# EAGLE schematic Solar_Irradiance_Sensor (EAGLE 7.1.0)
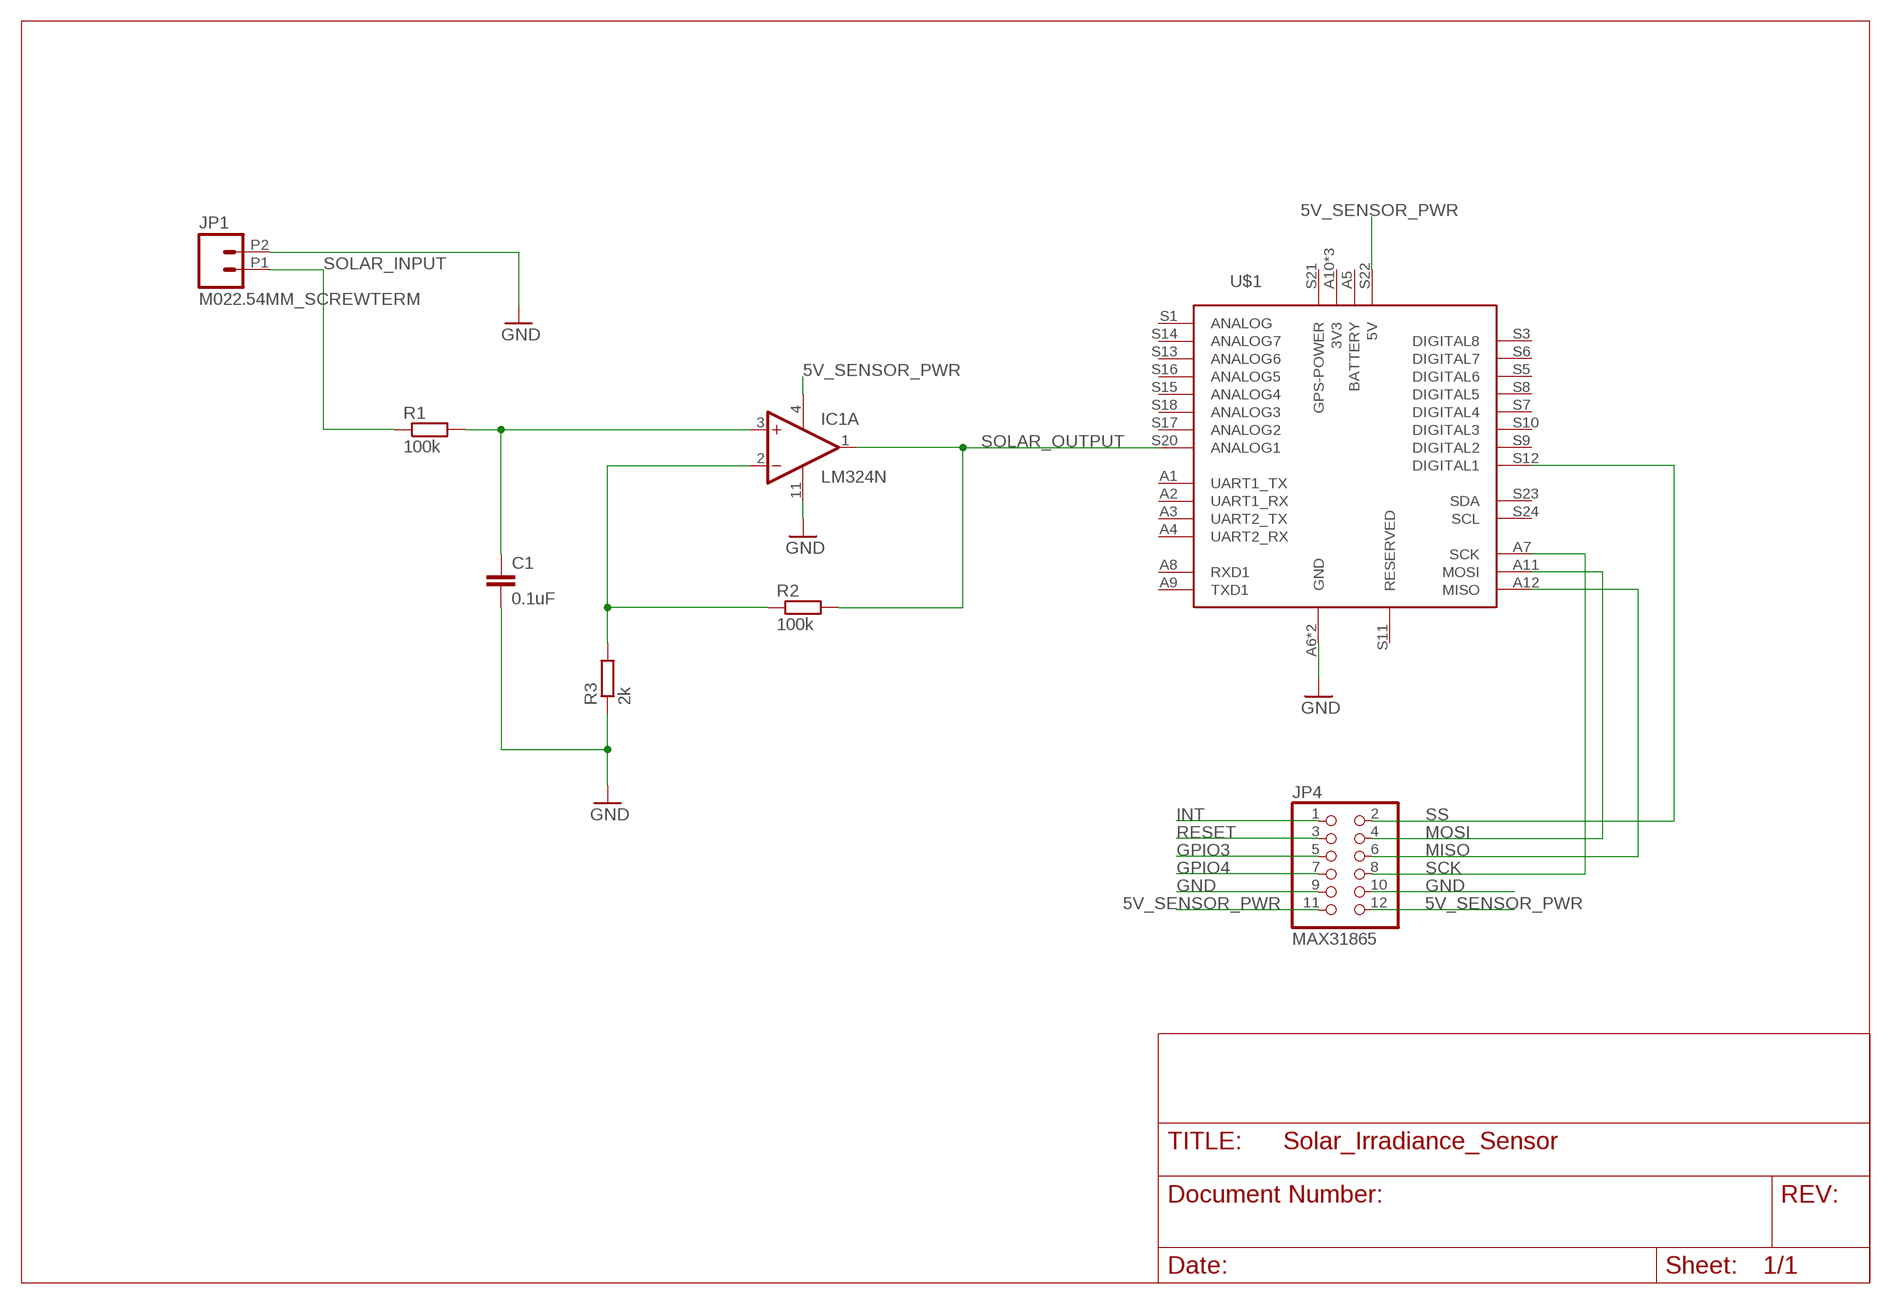
[diagram p0: schematic, sheet 1]

## Parts
C1  0.1uF  C-EU025-024X044  [C025-024X044]
IC1  LM324N  [DIL14]
JP1  M022.54MM_SCREWTERM  [1X02_2.54_SCREWTERM]
JP4  MAX31865  PINHD-2X6  [2X06]
R1  100k  R-EU_0207/10  [0207/10]
R2  100k  R-EU_0207/10  [0207/10]
R3  2k  R-EU_0207/10  [0207/10]
U$1  WASP  [WASP]

## Nets
5V_SENSOR_PWR: IC1.4(P:V+) JP4.11 JP4.12 U$1.S22(5V)
GND: C1.2 IC1.11(P:V-) JP1.P2 JP4.9 JP4.10 R3.1 U$1.A6(GND) U$1.S4(GND)
GPIO3: JP4.5
GPIO4: JP4.7
INT: JP4.1
MISO: JP4.6 U$1.A12(MISO)
MOSI: JP4.4 U$1.A11(MOSI)
N$1: IC1.2(A:-IN) R2.1 R3.2
N$3: C1.1 IC1.3(A:+IN) R1.2
RESET: JP4.3
SCK: JP4.8 U$1.A7(SCK)
SOLAR_INPUT: JP1.P1 R1.1
SOLAR_OUTPUT: IC1.1(A:OUT) R2.2 U$1.S20(ANALOG1)
SS: JP4.2 U$1.S12(DIGITAL1)
Unconnected: IC1.5(B:+IN) IC1.6(B:-IN) IC1.7(B:OUT) IC1.8(C:OUT) IC1.9(C:-IN) IC1.10(C:+IN) IC1.12(D:+IN) IC1.13(D:-IN) IC1.14(D:OUT) U$1.A1(UART1_TX) U$1.A2(UART1_RX) U$1.A3(UART2_TX) U$1.A4(UART2_RX) U$1.A5(BATTERY) U$1.A8(RXD1) U$1.A9(TXD1) U$1.A10(3V3) U$1.S1(ANALOG) U$1.S2(3V3) U$1.S3(DIGITAL8) U$1.S5(DIGITAL6) U$1.S6(DIGITAL7) U$1.S7(DIGITAL4) U$1.S8(DIGITAL5) U$1.S9(DIGITAL2) U$1.S10(DIGITAL3) U$1.S11(RESERVED) U$1.S13(ANALOG6) U$1.S14(ANALOG7) U$1.S15(ANALOG4) U$1.S16(ANALOG5) U$1.S17(ANALOG2) U$1.S18(ANALOG3) U$1.S19(3V3) U$1.S21(GPS-POWER) U$1.S23(SDA) U$1.S24(SCL)

## Library data of the parts
C1 = rcl:C-EU: CAPACITOR, European symbol
IC1 = linear:LM324: OP AMP
JP1 = SparkFun-Connectors:M02: Standard 2-pin 0.1" header. Use with - straight break away headers ( PRT-00116) - right angle break away headers (PRT-00553) - swiss pins (PRT-00743) - machine pins (PRT-00117) - female headers (PRT-00115) Molex polarized connector foot print use with: PRT-08233 with associated crimp pins and housings. 2.54_SCREWTERM for use with PRT-10571. 3.5mm Screw Terminal footprints for PRT-08084 5mm Screw Terminal footprints for use with PRT-08432
JP4 = pinhead:PINHD-2X6: PIN HEADER
R1-R3 = rcl:R-EU_: RESISTOR, European symbol
U$1 = wasp:WASP